# EAGLE design TelephoneConnect (EAGLE 9.2.0)
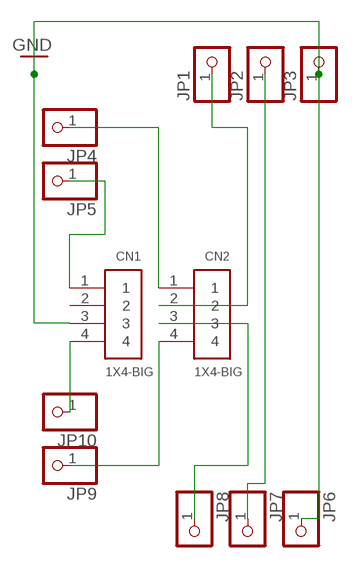
[diagram p0: schematic, sheet 1]

## Parts
CN1  1X4-BIG  [1X04-BIG]
CN2  1X4-BIG  [1X04-BIG]
JP1  PINHD-1X1  [1X01]
JP2  PINHD-1X1  [1X01]
JP3  PINHD-1X1  [1X01]
JP4  PINHD-1X1  [1X01]
JP5  PINHD-1X1  [1X01]
JP6  PINHD-1X1  [1X01]
JP7  PINHD-1X1  [1X01]
JP8  PINHD-1X1  [1X01]
JP9  PINHD-1X1  [1X01]
JP10  PINHD-1X1  [1X01]

## Nets
GND: CN1.3 JP3.1 JP6.1
N$1: CN1.1 JP5.1
N$2: CN2.1 JP4.1
N$3: CN1.4 JP10.1
N$4: CN2.4 JP9.1
N$5: CN2.3 JP8.1
N$6: CN2.2 JP1.1
N$7: JP2.1 JP7.1
Unconnected: CN1.2

## Library data of the parts
CN1 CN2 = adafruit:1X4: 4-pin connector
JP1-JP10 = adafruit:PINHD-1X1: Pin header 1x1 for 0.1" spacing With round pins

## Net classes
0 default: width 1.016 mm, drill 0.076 mm

## Board
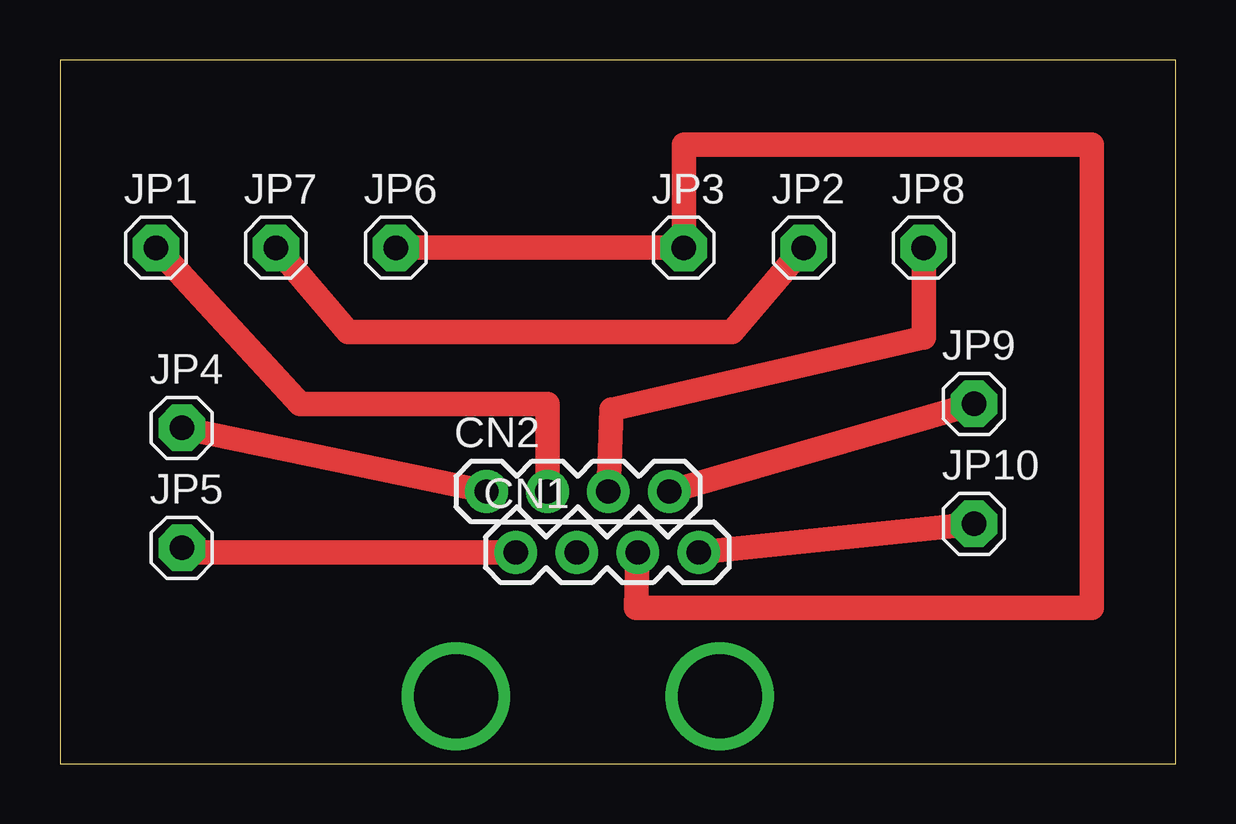
[diagram p1: board, top side]

Size 46.51 x 29.34 mm. Coordinates in mm from the lower left corner, seen from the top.
Outline: 0,0 46.51,0 46.51,29.34 0,29.34 0,0
Copper layers (1*16): Top 0.035mm / dielectric 1.5mm / Bottom 0.035mm
Design rules "OthermillDRC_1_32_v2": minimum track width 8mil, minimum drill 0.8mm, track to track 0.794003125mm, track to pad 0.794003125mm, pad to pad 0.794003125mm, via to via 0.794003125mm, smd to smd 0mil, copper to edge 0mil, drill to drill 1mil, minimum pad ring 10mil, minimum via ring 10mil, stop-mask expansion 1mil, vias tented up to drill 30mil, thermal gap 10mil

### Footprints (pad centres in the part's own frame; a part is rotated, then mirrored left to right if it is on the bottom)
1X04-BIG = drill 1.016 pad 1.778: 1 0,0; 2 2.54,0; 3 5.08,0; 4 7.62,0
1X01 = drill 1.016 pad 1.93 octagon: 1 0,0

### Placement (x,y rotation side)
CN1  19,8.81 0 top
CN2  17.78,11.35 0 top
JP1  4,21.51 0 top
JP2  31,21.51 0 top
JP3  26,21.51 0 top
JP4  5.08,14 0 top
JP5  5.08,9 0 top
JP6  14,21.51 0 top
JP7  9,21.51 0 top
JP8  36,21.51 0 top
JP9  38.1,15 0 top
JP10  38.1,10 0 top

### Tracks (layer width: path | path; a pad name or v marks a point on that pad's centre or on a via)
GND
  Top 1.016: JP6.1 JP3.1 26,25.82 43,25.82 43,6.5 24,6.5 CN1.3
N$1
  Top 1.016: CN1.1 5.27,8.81 JP5.1
N$2
  Top 1.016: JP4.1 CN2.1
N$3
  Top 1.016: CN1.4 JP10.1
N$4
  Top 1.016: CN2.4 JP9.1
N$5
  Top 1.016: CN2.3 22.99,14.77 36,17.77 JP8.1
N$6
  Top 1.016: CN2.2 20.32,15 10,15 JP1.1
N$7
  Top 1.016: JP7.1 12,18 28,18 JP2.1
N$8  (via drill 3.5 pad 1.3)
  other vias: 16.5,2.81
N$9  (via drill 3.5 pad 1.3)
  other vias: 27.5,2.81